# Altium schematic sheet stm32_board.SchDoc
size A4
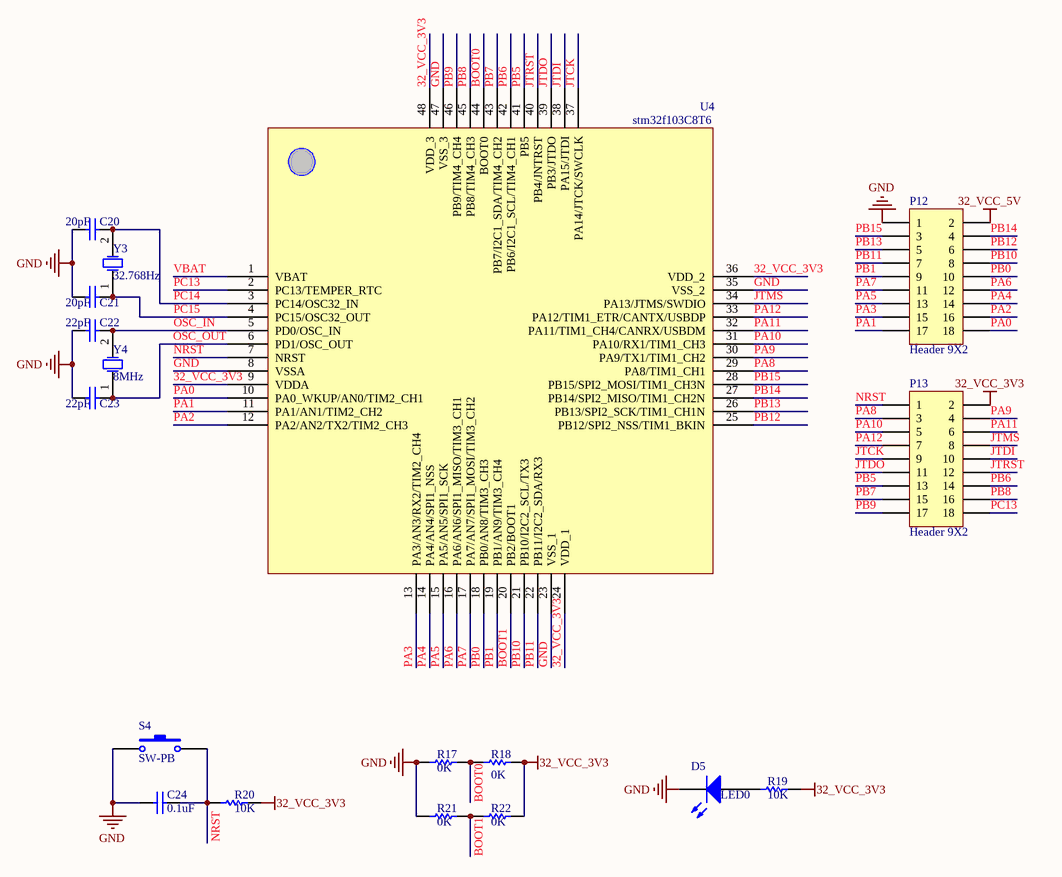
[diagram p0: stm32_board.SchDoc]

## Parts
C20  value 20pF  [6-0805_N]
C21  value 20pF  [6-0805_N]
C22  value 22pF  [6-0805_N]
C23  value 22pF  [6-0805_N]
C24  value 0.1uF  [6-0805_N]
D5  LED0  [LED]
P12  Header 9X2  [XDR2x9]
P13  Header 9X2  [XDR2x9]
R17  value 0K  [0402]
R18  value 0K  [0402]
R19  value 10K  [6-0805_N]
R20  value 10K  [6-0805_N]
R21  value 0K  [0402]
R22  value 0K  [0402]
S4  SW-PB  [SPST-2]
U4  stm32f103C8T6  [LQFP48]
Y3  32.768Hz  [HDR1X2]
Y4  8MHz  [HC-49S]

## Nets
32_VCC_3V3: P13.2 R18.2 R19.2 R20.2 R22.2 U4.9(VDDA) U4.24(VDD_1) U4.36(VDD_2) U4.48(VDD_3)
32_VCC_5V: P12.2
GND: C20.1 C21.1 C22.1 C23.1 C24.1 D5.2(K) P12.1 R17.1 R21.1 S4.1 U4.8(VSSA) U4.23(VSS_1) U4.35(VSS_2) U4.47(VSS_3)
BOOT0: R17.2 R18.1 U4.44(BOOT0)
BOOT1: R21.2 R22.1 U4.20(PB2/BOOT1)
JTCK: P13.9 U4.37(PA14/JTCK/SWCLK)
JTDI: P13.10 U4.38(PA15/JTDI)
JTDO: P13.11 U4.39(PB3/JTDO)
JTMS: P13.8 U4.34(PA13/JTMS/SWDIO)
JTRST: P13.12 U4.40(PB4/JNTRST)
NRST: C24.2 P13.1 R20.1 S4.2 U4.7(NRST)
OSC_IN: C22.2 U4.5(PD0/OSC_IN) Y4.2(OSC2)
OSC_OUT: C23.2 U4.6(PD1/OSC_OUT) Y4.1(OSC1)
PA0: P12.18 U4.10(PA0_WKUP/AN0/TIM2_CH1)
PA1: P12.17 U4.11(PA1/AN1/TIM2_CH2)
PA2: P12.16 U4.12(PA2/AN2/TX2/TIM2_CH3)
PA3: P12.15 U4.13(PA3/AN3/RX2/TIM2_CH4)
PA4: P12.14 U4.14(PA4/AN4/SPI1_NSS)
PA5: P12.13 U4.15(PA5/AN5/SPI1_SCK)
PA6: P12.12 U4.16(PA6/AN6/SPI1_MISO/TIM3_CH1)
PA7: P12.11 U4.17(PA7/AN7/SPI1_MOSI/TIM3_CH2)
PA8: P13.3 U4.29(PA8/TIM1_CH1)
PA9: P13.4 U4.30(PA9/TX1/TIM1_CH2)
PA10: P13.5 U4.31(PA10/RX1/TIM1_CH3)
PA11: P13.6 U4.32(PA11/TIM1_CH4/CANRX/USBDM)
PA12: P13.7 U4.33(PA12/TIM1_ETR/CANTX/USBDP)
PB0: P12.10 U4.18(PB0/AN8/TIM3_CH3)
PB1: P12.9 U4.19(PB1/AN9/TIM3_CH4)
PB5: P13.13 U4.41(PB5)
PB6: P13.14 U4.42(PB6/I2C1_SCL/TIM4_CH1)
PB7: P13.15 U4.43(PB7/I2C1_SDA/TIM4_CH2)
PB8: P13.16 U4.45(PB8/TIM4_CH3)
PB9: P13.17 U4.46(PB9/TIM4_CH4)
PB10: P12.8 U4.21(PB10/I2C2_SCL/TX3)
PB11: P12.7 U4.22(PB11/I2C2_SDA/RX3)
PB12: P12.6 U4.25(PB12/SPI2_NSS/TIM1_BKIN)
PB13: P12.5 U4.26(PB13/SPI2_SCK/TIM1_CH1N)
PB14: P12.4 U4.27(PB14/SPI2_MISO/TIM1_CH2N)
PB15: P12.3 U4.28(PB15/SPI2_MOSI/TIM1_CH3N)
PC13: P13.18 U4.2(PC13/TEMPER_RTC)
PC14: C20.2 U4.3(PC14/OSC32_IN) Y3.2(OSC2)
PC15: C21.2 U4.4(PC15/OSC32_OUT) Y3.1(OSC1)
VBAT: U4.1(VBAT)
NetD5_1: D5.1(A) R19.1

## Library data of the parts
C20-C24 = Cap: Capacitor; Published: 8-Jun-2000; LatestRevisionDate: 17-Jul-2002; LatestRevisionNote: Re-released for DXP Platform.; PackageReference: RAD-0.3; Publisher: Altium Limited; PackageDescription: Radial Cap, Thru-Hole; 2 Leads; 0.3 in Pin Spacing
D5 = LED0: Typical INFRARED GaAs LED; Published: 8-Jun-2000; LatestRevisionDate: 08-Jul-2005; LatestRevisionNote: Mech Layer 1 removed.; PackageReference: LED-0; Publisher: Altium Limited; PackageDescription: LED; 2 Leads
P12 P13 = Header 9X2: Header, 9-Pin, Dual row; LatestRevisionDate: 17-Jul-2002; LatestRevisionNote: Re-released for DXP Platform.; Publisher: Altium Limited
R17-R22 = Res1: Resistor; Published: 8-Jun-2000; LatestRevisionDate: 17-Jul-2002; LatestRevisionNote: Re-released for DXP Platform.; PackageReference: AXIAL-0.3; Publisher: Altium Limited; PackageDescription: Axial Device, Thru-Hole; 2 Leads; 0.3 in Pin Spacing
S4 = SW-PB: Switch; Published: 24-Mar-1999; LatestRevisionDate: 17-Jul-2002; LatestRevisionNote: Re-released for DXP Platform.; PackageReference: SPST-2; Publisher: Altium Limited; PackageDescription: Switch; 2 Leads
Y3 Y4 = XTAL: Crystal Oscillator; Published: 8-Jun-2000; LatestRevisionDate: 17-Jul-2002; LatestRevisionNote: Re-released for DXP Platform.; PackageReference: R38; Publisher: Altium Limited; PackageDescription: Crystal, Thru-Hole; 2 Leads; Body 3.1 x 8.2 mm (Dia.xH)